# EAGLE schematic driver_board_v00 (EAGLE 7.4.0)
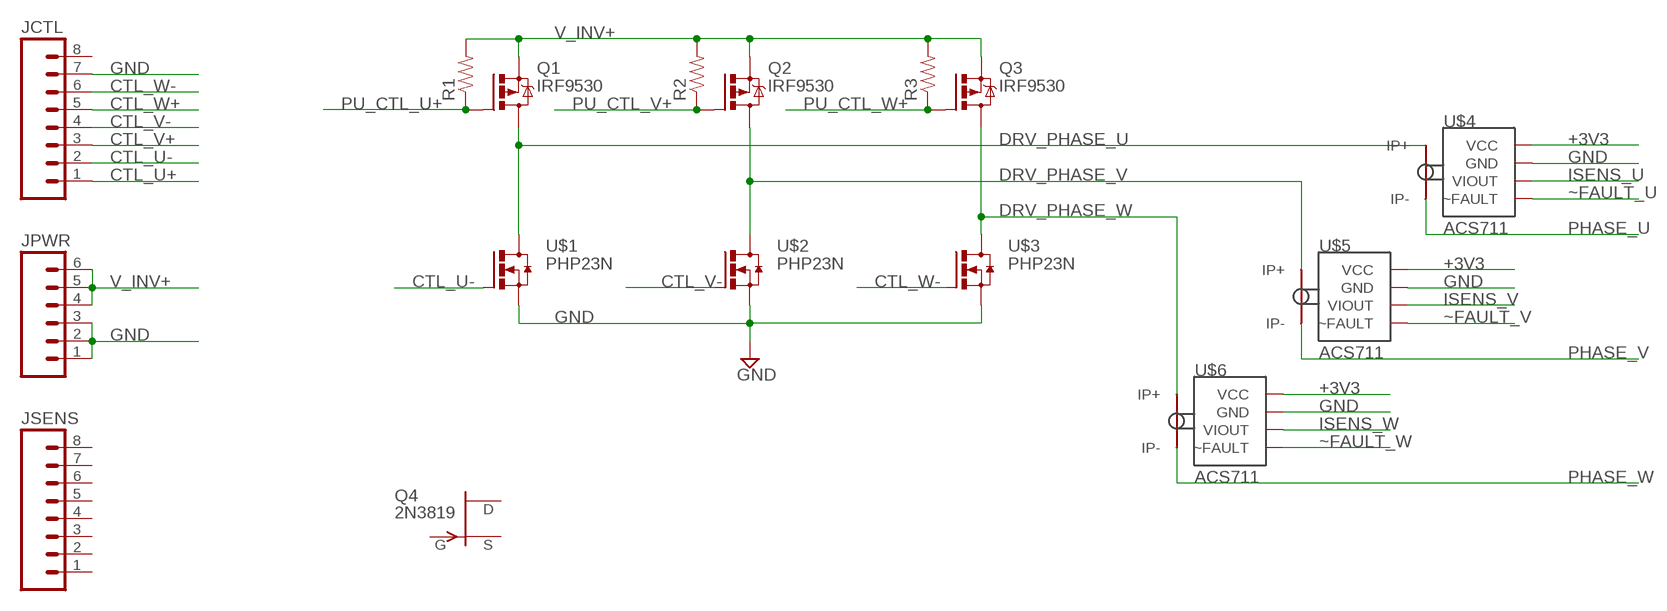
[diagram p0: schematic, sheet 1]

## Parts
JCTL  M08LOCK  [1X08_LOCK]
JPWR  M06LOCK  [1X06_LOCK]
JSENS  M08LOCK  [1X08_LOCK]
Q1  IRF9530  [TO220BV]
Q2  IRF9530  [TO220BV]
Q3  IRF9530  [TO220BV]
Q4  2N3819  [TO92]
R1  RESISTOR0603  [0603-RES]
R2  RESISTOR0603  [0603-RES]
R3  RESISTOR0603  [0603-RES]
U$1  PHP23N  [TO220BV]
U$2  PHP23N  [TO220BV]
U$3  PHP23N  [TO220BV]
U$4  ACS711  [12-WFQFN]
U$5  ACS711  [12-WFQFN]
U$6  ACS711  [12-WFQFN]

## Nets
+3V3: U$4.P$12(VCC) U$5.P$12(VCC) U$6.P$12(VCC)
CTL_U+: JCTL.1
CTL_U-: JCTL.2 U$1.G
CTL_V+: JCTL.3
CTL_V-: JCTL.4 U$2.G
CTL_W+: JCTL.5
CTL_W-: JCTL.6 U$3.G
DRV_PHASE_U: Q1.D U$1.D U$4.P$1-2(IP+)
DRV_PHASE_V: Q2.D U$2.D U$5.P$1-2(IP+)
DRV_PHASE_W: Q3.D U$3.D U$6.P$1-2(IP+)
GND: JCTL.7 JPWR.1 JPWR.2 JPWR.3 U$1.S U$2.S U$3.S U$4.P$5(GND) U$5.P$5(GND) U$6.P$5(GND)
ISENS_U: U$4.P$11(VIOUT)
ISENS_V: U$5.P$11(VIOUT)
ISENS_W: U$6.P$11(VIOUT)
PHASE_U: U$4.P$3-4(IP-)
PHASE_V: U$5.P$3-4(IP-)
PHASE_W: U$6.P$3-4(IP-)
PU_CTL_U+: Q1.G R1.1
PU_CTL_V+: Q2.G R2.1
PU_CTL_W+: Q3.G R3.1
V_INV+: JPWR.4 JPWR.5 JPWR.6 Q1.S Q2.S Q3.S R1.2 R2.2 R3.2
~FAULT_U: U$4.P$6(~FAULT)
~FAULT_V: U$5.P$6(~FAULT)
~FAULT_W: U$6.P$6(~FAULT)
Unconnected: JCTL.8 JSENS.1 JSENS.2 JSENS.3 JSENS.4 JSENS.5 JSENS.6 JSENS.7 JSENS.8 Q4.1(D) Q4.2(G) Q4.3(S)

## Library data of the parts
JCTL JSENS = SparkFun-Connectors:M08: Header 8 Standard 8-pin 0.1" header. Use with straight break away headers (SKU : PRT-00116), right angle break away headers (PRT-00553), swiss pins (PRT-00743), machine pins (PRT-00117), and female headers (PRT-00115).
JPWR = SparkFun-Connectors:M06: Header 6 Standard 6-pin 0.1" header. Use with straight break away headers (SKU : PRT-00116), right angle break away headers (PRT-00553), swiss pins (PRT-00743), machine pins (PRT-00117), and female headers (PRT-00115). Molex polarized connector foot print use with SKU : PRT-08094 with associated crimp pins and housings. NOTES ON THE VARIANTS LOCK and LOCK_LONGPADS... This footprint was designed to help hold the alignment of a through-hole component (i.e. 6-pin header) while soldering it into place. You may notice that each hole has been shifted either up or down by 0.005 of an inch from it's more standard position (which is a perfectly straight line). This slight alteration caused the pins (the squares in the middle) to touch the edges of the holes. Because they are alternating, it causes a "brace" to hold the component in place. 0.005 has proven to be the perfect amount of "off-center" position when using our standard breakaway headers. Although looks a little odd when you look at the bare footprint, once you have a header in there, the alteration is very hard to notice. Also,if you push a header all the way into place, it is covered up entirely on the bottom side. This idea of altering the position of holes to aid alignment will be further integrated into the Sparkfun Library for other footprints. It can help hold any component with 3 or more connection pins.
Q1-Q3 = transistor-power:IRF9530: P-CHANNEL HEXFET POWER-MOS-FET Source: http://www.irf.com/product-info/datasheets/data/irf9530.pdf
Q4 = transistor-fet:2N3819: N-Channel Junction FET
R1-R3 = SparkFun-Resistors:RESISTOR: Resistor Basic schematic elements and footprints for 0603, 1206, and PTH resistors.
U$1-U$3 = StationaryBike_lib_v00:PHP23N
U$4-U$6 = StationaryBike_lib_v01:ACS711: ACS711 hall effect current sensor, 12-pin WFQFN Package; DIGIKEY: 620-1484-1-ND; MODEL: ACS711EEXLT-31AB-T